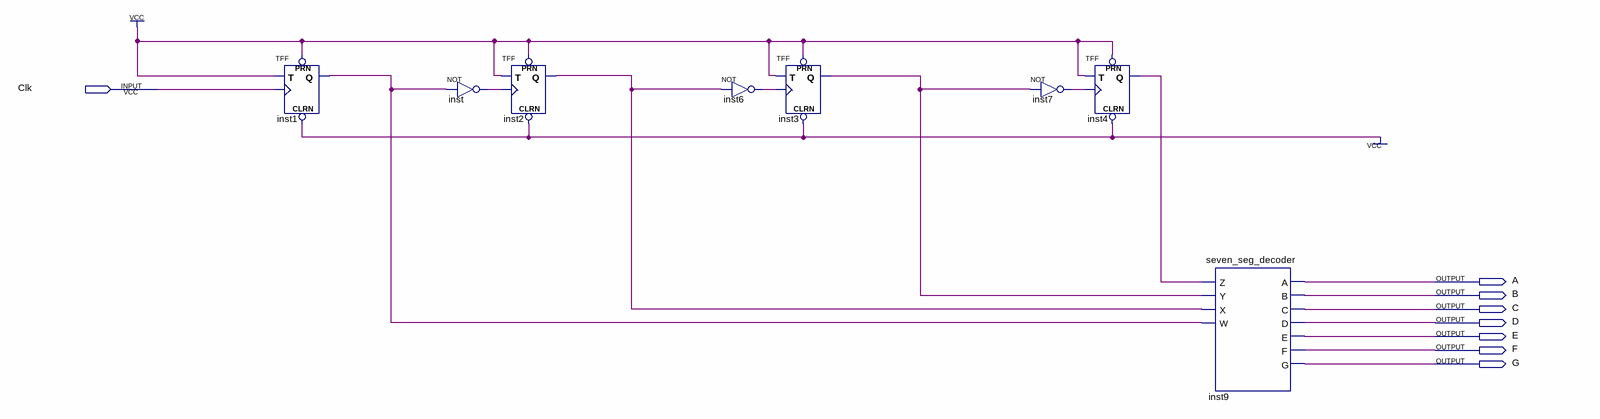
[diagram p0: schematic sheet]
// Quartus schematic lab10step3a.bdf as structural Verilog: 8 symbols, 8 pins
module lab10step3a (
  input  Clk,
  output A,
  output B,
  output C,
  output D,
  output E,
  output F,
  output G
);

  wire inst1_q, inst2_q, inst3_q, inst4_q, inst6_out, inst7_out, inst_out;

  TFF inst1 (.PRN(1'b1), .CLRN(1'b1), .T(1'b1), .CLK(Clk), .Q(inst1_q));
  not inst (inst_out, inst1_q);
  TFF inst2 (.PRN(1'b1), .CLRN(1'b1), .T(1'b1), .CLK(inst_out), .Q(inst2_q));
  not inst6 (inst6_out, inst2_q);
  TFF inst3 (.PRN(1'b1), .CLRN(1'b1), .T(1'b1), .CLK(inst6_out), .Q(inst3_q));
  not inst7 (inst7_out, inst3_q);
  TFF inst4 (.PRN(1'b1), .CLRN(1'b1), .T(1'b1), .CLK(inst7_out), .Q(inst4_q));
  seven_seg_decoder inst9 (
    .Z(inst4_q), .Y(inst3_q), .X(inst2_q), .W(inst1_q), .A(A), .B(B), .C(C), .D(D), .E(E), .F(F), .G(G));
endmodule
